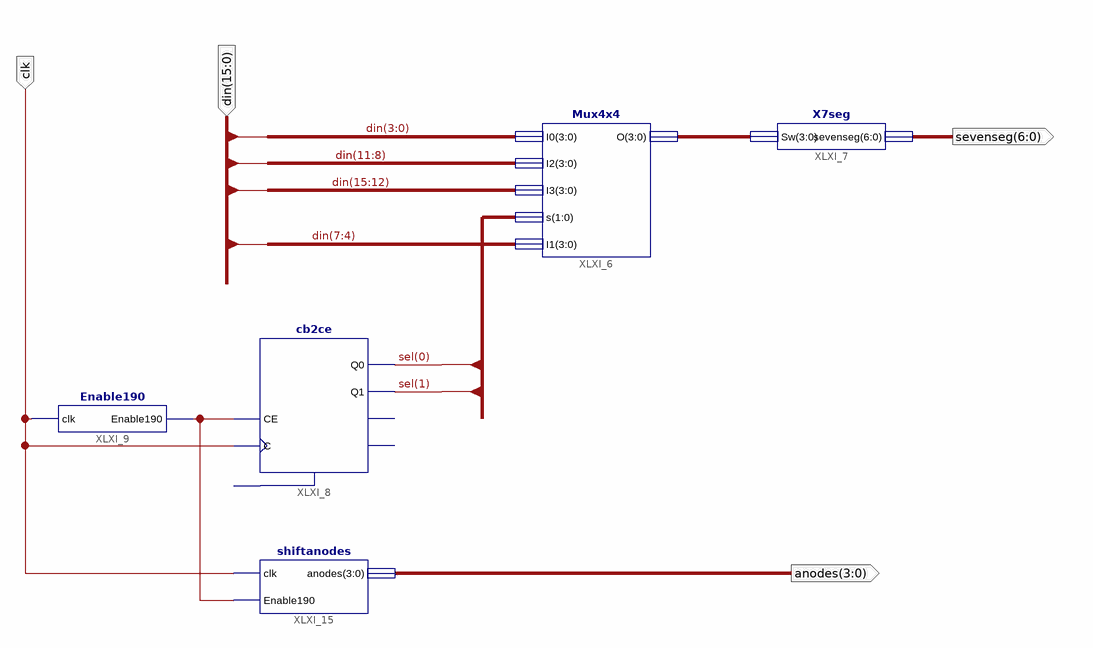
[diagram p0: schematic sheet 1]
// Xilinx ISE schematic afficheur.sch (spartan6) as structural Verilog: 5 symbols, 4 ports
module afficheur (
  input  clk,
  input  [15:0] din,
  output [6:0] sevenseg,
  output [3:0] anodes
);

  wire XLXN_29;
  wire [1:0] sel;
  wire [3:0] XLXN_14;

  Enable190 XLXI_9 (.clk(clk), .Enable190(XLXN_29));
  Mux4x4 XLXI_6 (.I0(din[3:0]), .I2(din[11:8]), .I3(din[15:12]), .s(sel), .I1(din[7:4]), .O(XLXN_14));
  X7seg XLXI_7 (.Sw(XLXN_14), .sevenseg(sevenseg));
  cb2ce XLXI_8 (.C(clk), .CE(XLXN_29), .Q0(sel[0]), .Q1(sel[1]));  // open: CLR, CEO, TC
  shiftanodes XLXI_15 (.clk(clk), .Enable190(XLXN_29), .anodes(anodes));
endmodule
